# Altium schematic sheet XMOS_power.SchDoc
size Tabloid; DocumentNumber: 3; SheetNumber: 3; SheetTotal: 11; SheetName: XMOS power supply
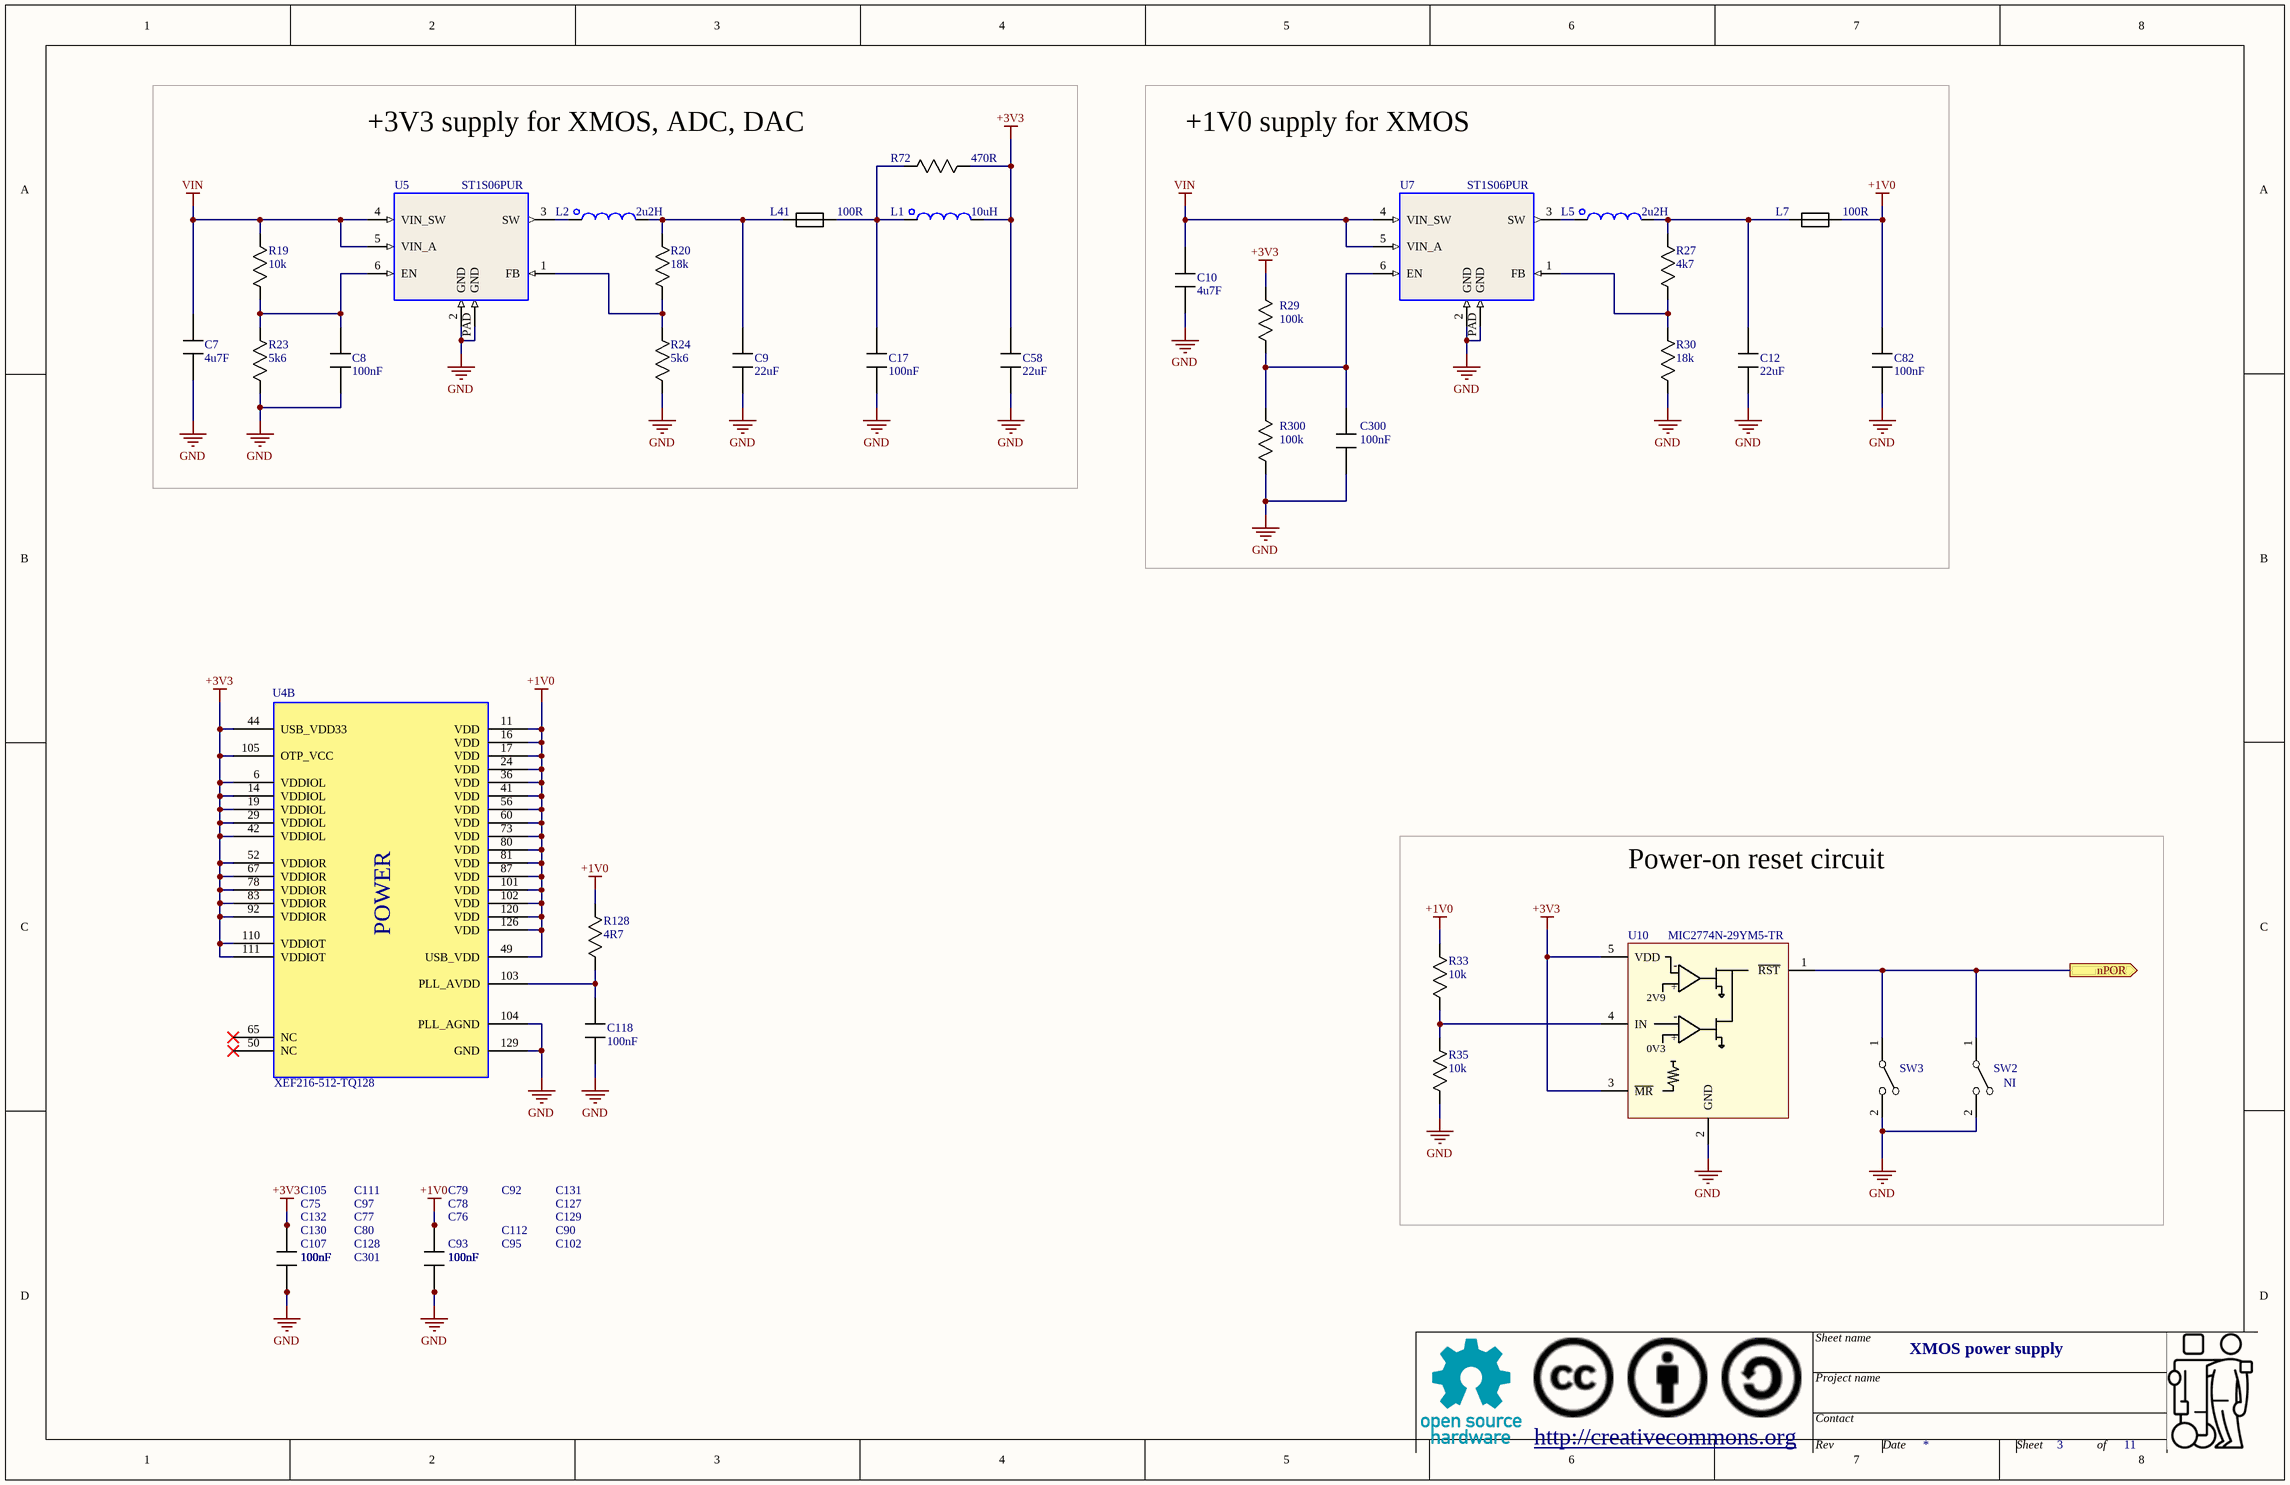
[diagram p0: XMOS_power.SchDoc]

## Parts
C7  value 4u7F  [0805]  (hidden comment: Capacitor)
C8  value 100nF  [0603]  (hidden comment: Capacitor)
C9  value 22uF  [1206]  (hidden comment: Capacitor)
C10  value 4u7F  [0805]  (hidden comment: Capacitor)
C12  value 22uF  [1206]  (hidden comment: Capacitor)
C17  value 100nF  [0603]  (hidden comment: Capacitor)
C58  value 22uF  [1206]  (hidden comment: Capacitor)
C75  value 100nF  [0603]  (hidden comment: Capacitor)
C76  value 100nF  [0603]  (hidden comment: Capacitor)
C77  value 100nF  [0603]  (hidden comment: Capacitor)
C78  value 100nF  [0603]  (hidden comment: Capacitor)
C79  value 100nF  [0603]  (hidden comment: Capacitor)
C80  value 100nF  [0603]  (hidden comment: Capacitor)
C82  value 100nF  [0603]  (hidden comment: Capacitor)
C90  value 100nF  [0603]  (hidden comment: Capacitor)
C92  value 100nF  [0603]  (hidden comment: Capacitor)
C93  value 100nF  [0603]  (hidden comment: Capacitor)
C95  value 100nF  [0603]  (hidden comment: Capacitor)
C97  value 100nF  [0603]  (hidden comment: Capacitor)
C102  value 100nF  [0603]  (hidden comment: Capacitor)
C105  value 100nF  [0603]  (hidden comment: Capacitor)
C107  value 100nF  [0603]  (hidden comment: Capacitor)
C111  value 100nF  [0603]  (hidden comment: Capacitor)
C112  value 100nF  [0603]  (hidden comment: Capacitor)
C118  value 100nF  [0603]  (hidden comment: Capacitor)
C127  value 100nF  [0603]  (hidden comment: Capacitor)
C128  value 100nF  [0603]  (hidden comment: Capacitor)
C129  value 100nF  [0603]  (hidden comment: Capacitor)
C130  value 100nF  [0603]  (hidden comment: Capacitor)
C131  value 100nF  [0603]  (hidden comment: Capacitor)
C132  value 100nF  [0603]  (hidden comment: Capacitor)
C300  value 100nF  [0603]  (hidden comment: Capacitor)
C301  value 100nF  [0603]  (hidden comment: Capacitor)
L1  value 10uH  [IND_252012CDMC/DS]  (hidden comment: Inductor)
L2  value 2u2H  [IND_252012CDMC/DS]  (hidden comment: Inductor)
L5  value 2u2H  [IND_252012CDMC/DS]  (hidden comment: Inductor)
L7  value 100R  [0805]  (hidden comment: Ferrite)
L41  value 100R  [0805]  (hidden comment: Ferrite)
R19  value 10k  [0603]  (hidden comment: Resistor)
R20  value 18k  [0603]  (hidden comment: Resistor)
R23  value 5k6  [0603]  (hidden comment: Resistor)
R24  value 5k6  [0603]  (hidden comment: Resistor)
R27  value 4k7  [0603]  (hidden comment: Resistor)
R29  value 100k  [0603]  (hidden comment: Resistor)
R30  value 18k  [0603]  (hidden comment: Resistor)
R33  value 10k  [0603]  (hidden comment: Resistor)
R35  value 10k  [0603]  (hidden comment: Resistor)
R72  value 470R  [0603]  (hidden comment: Resistor)
R128  value 4R7  [0603]  (hidden comment: Resistor)
R300  value 100k  [0603]  (hidden comment: Resistor)
SW2  Button  [BUTTON_WS-TASV]  (value not drawn)
SW3  Button  [BUTTON_WS-TASV]  (value not drawn)
U4  Mfg_PN: XEF216-512-TQ128  [TQFP128_XMOS]  (part B of 5)
U5  ST1S06PUR  [DFN6_ST1S06]
U7  ST1S06PUR  [DFN6_ST1S06]
U10  MIC2774N-29YM5-TR  [SOT23_5]

## Blocks framed on the sheet
+3V3 supply for XMOS, ADC, DAC: C7-C9 C17 C58 L1 L2 L41 R19 R20 R23 R24 R72 U5
+1V0 supply for XMOS: C10 C12 C82 C300 L5 L7 R27 R29 R30 R300 U7
Power-on reset circuit: R33 R35 SW2 SW3 U10

## Ports
nPOR (out)

## Nets
+1V0: C76.1 C78.1 C79.1 C82.1 C90.1 C92.1 C93.1 C95.1 C102.1 C112.1 C127.1 C129.1 C131.1 L7.2 R33.1 R128.1 U4.11(VDD) U4.16(VDD) U4.17(VDD) U4.24(VDD) U4.36(VDD) U4.41(VDD) U4.49(USB_VDD) U4.56(VDD) U4.60(VDD) U4.73(VDD) U4.80(VDD) U4.81(VDD) U4.87(VDD) U4.101(VDD) U4.102(VDD) U4.120(VDD) U4.126(VDD)
+3V3: C58.1 C75.1 C77.1 C80.1 C97.1 C105.1 C107.1 C111.1 C128.1 C130.1 C132.1 C301.1 L1.2 R29.1 R72.1 U4.6(VDDIOL) U4.14(VDDIOL) U4.19(VDDIOL) U4.29(VDDIOL) U4.42(VDDIOL) U4.44(USB_VDD33) U4.52(VDDIOR) U4.67(VDDIOR) U4.78(VDDIOR) U4.83(VDDIOR) U4.92(VDDIOR) U4.105(OTP_VCC) U4.110(VDDIOT) U4.111(VDDIOT) U10.3(~{MR}) U10.5(VDD)
GND: C7.2 C8.2 C9.2 C10.2 C12.2 C17.2 C58.2 C75.2 C76.2 C77.2 C78.2 C79.2 C80.2 C82.2 C90.2 C92.2 C93.2 C95.2 C97.2 C102.2 C105.2 C107.2 C111.2 C112.2 C118.2 C127.2 C128.2 C129.2 C130.2 C131.2 C132.2 C300.2 C301.2 R23.2 R24.2 R30.2 R35.2 R300.2 SW2.2 SW3.2 U4.104(PLL_AGND) U4.129(GND) U5.2(GND) U5.PAD(GND) U7.2(GND) U7.PAD(GND) U10.2(GND)
VIN: C7.1 C10.1 R19.1 U5.4(VIN_SW) U5.5(VIN_A) U7.4(VIN_SW) U7.5(VIN_A)
nPOR: SW2.1 SW3.1 U10.1(~{RST}) ; port nPOR
NetC8_1: C8.1 R19.2 R23.1 U5.6(EN)
NetC9_1: C9.1 L2.2 L41.1 R20.1
NetC12_1: C12.1 L5.2 L7.1 R27.1
NetC17_1: C17.1 L1.1 L41.2 R72.2
NetC118_1: C118.1 R128.2 U4.103(PLL_AVDD)
NetC300_1: C300.1 R29.2 R300.1 U7.6(EN)
NetL2_1: L2.1 U5.3(SW)
NetL5_1: L5.1 U7.3(SW)
NetR20_2: R20.2 R24.1 U5.1(FB)
NetR27_2: R27.2 R30.1 U7.1(FB)
NetR33_2: R33.2 R35.1 U10.4(IN)

Not connected (* = marked no-connect by the designer): SW2 3 4; SW3 3 4; U4 50(NC)* 65(NC)*

## Notes on the sheet
- Sheet name
- http://creativecommons.org
- Project name
- Contact
- Rev
- Date
- Sheet
- of
- (in symbol MIC2774N-29YM5-TR) -; +; 2V9; 0V3
- (in symbol XMOS_XEF216-512-TQ128, part B) POWER

## Library data of the parts
C7 C10 = Capacitor: Mfg: Samsung; Mfg_PN: CL21A475KAQNNNG; HelpURL: *; NI: *; Supplier1: Digikey; Supplier1_PN: 1276-6462-1-ND; Tolerance: *; Type: *; Rating: *
C8 C17 C75-C80 C82 C90 C92 C93 C95 C97 C102 C105 C107 C111 C112 C118 C127-C132 C300 C301 = Capacitor: Mfg: Samsung; Mfg_PN: CL10F104ZO8NNNC; HelpURL: *; NI: *; Supplier1: Digikey; Supplier1_PN: 1276-1258-1-ND; Tolerance: *; Type: *; Rating: *
C9 C12 C58 = Capacitor: Mfg: Samsung; Mfg_PN: CL31F226ZPHNNNE; HelpURL: *; NI: *; Supplier1: Digikey; Supplier1_PN: 1276-3296-1-ND; Tolerance: *; Type: *; Rating: *
L1 = Inductor: Mfg: Murata; Mfg_PN: DFE252012F-100M=P2; HelpURL: *; NI: *; Rating: *; Tolerance: *; Supplier1: Digikey; Supplier1_PN: 490-13050-1-ND
L2 L5 = Inductor: Mfg: Murata; Mfg_PN: DFE252012F-2R2M=P2; HelpURL: *; NI: *; Rating: *; Tolerance: *; Supplier1: Digikey; Supplier1_PN: 490-13055-1-ND
L7 L41 = Ferrite: Mfg: Bourns; Mfg_PN: MH2029-101Y; Rating: 1A; HelpURL: *; NI: *; Supplier1: Digikey; Supplier1_PN: MH2029-101YCT-ND; Tolerance: *; Type: *
R19 R33 R35 = Resistor: Mfg: Yageo; Mfg_PN: RC0603JR-0710KL; HelpURL: *; NI: *; Supplier1: Digikey; Supplier1_PN: 311-10KGRCT-ND; Type: *; Rating: *; Tolerance: *
R20 R30 = Resistor: Mfg: Yageo; Mfg_PN: RC0603JR-0718KL; HelpURL: *; NI: *; Supplier1: Digikey; Supplier1_PN: 311-18KGRCT-ND; Type: *; Rating: *; Tolerance: *
R23 R24 = Resistor: Mfg: Yageo; Mfg_PN: RC0603JR-075K6L; HelpURL: *; NI: *; Supplier1: Digikey; Supplier1_PN: 311-5.6KGRCT-ND; Type: *; Rating: *; Tolerance: *
R27 = Resistor: Mfg: Yageo; Mfg_PN: RC0603JR-074K7L; HelpURL: *; NI: *; Supplier1: Digikey; Supplier1_PN: 311-4.7KGRCT-ND; Type: *; Rating: *; Tolerance: *
R29 R300 = Resistor: Mfg: Yageo; Mfg_PN: 311-10GRCT-ND; HelpURL: *; NI: *; Supplier1: Digikey; Supplier1_PN: 311-100KGRCT-ND; Type: *; Rating: *; Tolerance: *
R72 = Resistor: Mfg: Yageo; Mfg_PN: RC0603JR-07470RL; HelpURL: *; NI: *; Supplier1: Digikey; Supplier1_PN: 311-470GRCT-ND; Type: *; Rating: *; Tolerance: *
R128 = Resistor: Mfg: Yageo; Mfg_PN: RC0603JR-074R7L; HelpURL: *; NI: *; Supplier1: Digikey; Supplier1_PN: 311-4.7GRCT-ND; Type: *; Rating: *; Tolerance: *
SW2 SW3 = Button: Mfg: Wurth; Mfg_PN: 430152050826; HelpURL: *; Rating: *; Tolerance: *; Value: *; Supplier1: Digikey; Supplier1_PN: 732-6993-1-ND
  SW2: NI: NI
  SW3: NI: *
U4 = XMOS_XEF216-512-TQ128: 32-bit multicore microcontroller. 2 Tiles. 16 Logical Cores. 512KB SRAM. 1000MIPS. TQFP128.; Mfg: XMOS; Supplier1: Digikey; Supplier1_PN: 880-1100-ND
U5 U7 = ST1S06PUR: DC-DC Buck Converter, 1.5A, 1.5MHz, DFN6; Mfg: ST Microelectronics; Mfg_PN: ST1S06PUR; Supplier1: Digikey; Supplier1_PN: 497-5802-1-ND
U10 = MIC2774N-29YM5-TR: Voltage supervisor and power-on timer, dual; Mfg: Micrel; HelpURL: *; Mfg_PN: MIC2774N-29YM5-TR; NI: *; Rating: *; Supplier1: Digikey; Supplier1_PN: 576-1101-1-ND; Tolerance: *; Type: *; Value: *